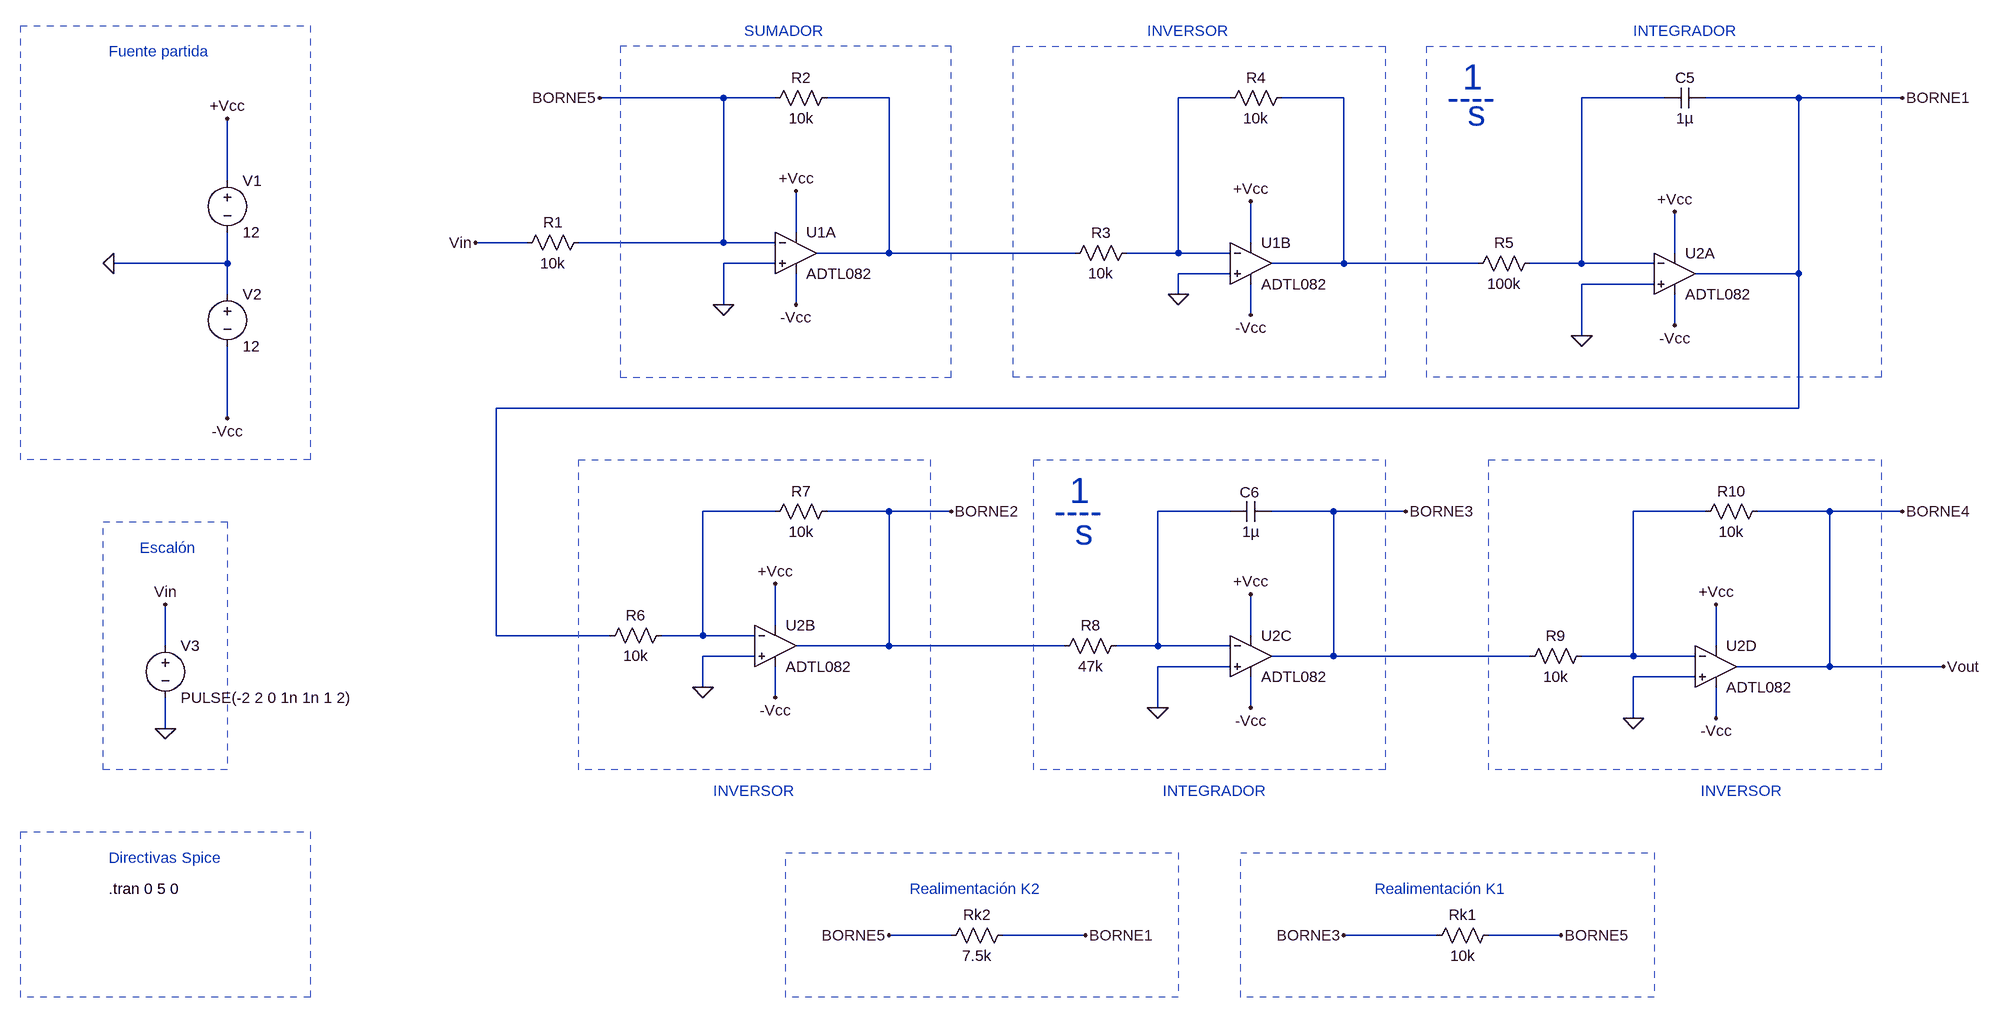
[diagram p0: schematic TP1.asc]
TP1.asc, the LTspice schematic file:
Version 4
SHEET 1 2500 1556
WIRE 128 -80 -64 -80
WIRE 208 -80 128 -80
WIRE 384 -80 288 -80
WIRE 912 -80 832 -80
WIRE 1088 -80 992 -80
WIRE 1584 -80 1456 -80
WIRE 1792 -80 1648 -80
WIRE 1952 -80 1792 -80
WIRE -640 48 -640 -48
WIRE 240 128 240 64
WIRE -176 144 -256 144
WIRE 128 144 128 -80
WIRE 128 144 -96 144
WIRE 208 144 128 144
WIRE 944 144 944 80
WIRE 384 160 384 -80
WIRE 384 160 272 160
WIRE 672 160 384 160
WIRE 832 160 832 -80
WIRE 832 160 752 160
WIRE 912 160 832 160
WIRE 1600 160 1600 96
WIRE -640 176 -640 128
WIRE -640 176 -816 176
WIRE 208 176 128 176
WIRE 1088 176 1088 -80
WIRE 1088 176 976 176
WIRE 1296 176 1088 176
WIRE 1456 176 1456 -80
WIRE 1456 176 1376 176
WIRE 1568 176 1456 176
WIRE 912 192 832 192
WIRE 1792 192 1792 -80
WIRE 1792 192 1632 192
WIRE 1568 208 1456 208
WIRE -640 224 -640 176
WIRE 832 224 832 192
WIRE 128 240 128 176
WIRE 240 240 240 192
WIRE 944 256 944 208
WIRE 1600 272 1600 224
WIRE 1456 288 1456 208
WIRE 1792 400 1792 192
WIRE 1792 400 -224 400
WIRE -640 416 -640 304
WIRE 208 560 96 560
WIRE 384 560 288 560
WIRE 480 560 384 560
WIRE 912 560 800 560
WIRE 1072 560 976 560
WIRE 1184 560 1072 560
WIRE 1648 560 1536 560
WIRE 1840 560 1728 560
WIRE 1952 560 1840 560
WIRE 208 736 208 672
WIRE -224 752 -224 400
WIRE -48 752 -224 752
WIRE 96 752 96 560
WIRE 96 752 32 752
WIRE 176 752 96 752
WIRE 944 752 944 688
WIRE -736 768 -736 704
WIRE 384 768 384 560
WIRE 384 768 240 768
WIRE 656 768 384 768
WIRE 800 768 800 560
WIRE 800 768 736 768
WIRE 912 768 800 768
WIRE 1664 768 1664 704
WIRE 176 784 96 784
WIRE 1072 784 1072 560
WIRE 1072 784 976 784
WIRE 1376 784 1072 784
WIRE 1536 784 1536 560
WIRE 1536 784 1456 784
WIRE 1632 784 1536 784
WIRE 912 800 800 800
WIRE 1840 800 1840 560
WIRE 1840 800 1696 800
WIRE 2016 800 1840 800
WIRE 1632 816 1536 816
WIRE 96 832 96 784
WIRE 208 848 208 800
WIRE 800 864 800 800
WIRE 944 864 944 816
WIRE 1536 880 1536 816
WIRE 1664 880 1664 832
WIRE -736 896 -736 848
WIRE 480 1216 384 1216
WIRE 688 1216 560 1216
WIRE 1232 1216 1088 1216
WIRE 1424 1216 1312 1216
FLAG 128 240 0
FLAG 832 224 0
FLAG 1456 288 0
FLAG 96 832 0
FLAG 800 864 0
FLAG 1536 880 0
FLAG -256 144 Vin
FLAG 240 64 +Vcc
FLAG 944 80 +Vcc
FLAG 1600 96 +Vcc
FLAG 208 672 +Vcc
FLAG 944 688 +Vcc
FLAG 1664 704 +Vcc
FLAG 240 240 -Vcc
FLAG 944 256 -Vcc
FLAG 1600 272 -Vcc
FLAG 208 848 -Vcc
FLAG 944 864 -Vcc
FLAG 1664 880 -Vcc
FLAG 2016 800 Vout
FLAG 1952 -80 BORNE1
FLAG 480 560 BORNE2
FLAG 1184 560 BORNE3
FLAG 1952 560 BORNE4
FLAG -64 -80 BORNE5
FLAG -816 176 0
FLAG -640 -48 +Vcc
FLAG -640 416 -Vcc
FLAG -736 896 0
FLAG -736 704 Vin
FLAG 384 1216 BORNE5
FLAG 688 1216 BORNE1
FLAG 1088 1216 BORNE3
FLAG 1424 1216 BORNE5
SYMBOL res -80 128 R90
WINDOW 0 0 56 VBottom 2
WINDOW 3 32 56 VTop 2
SYMATTR InstName R1
SYMATTR Value 10k
SYMBOL res 304 -96 R90
WINDOW 0 0 56 VBottom 2
WINDOW 3 32 56 VTop 2
SYMATTR InstName R2
SYMATTR Value 10k
SYMBOL res 768 144 R90
WINDOW 0 0 56 VBottom 2
WINDOW 3 32 56 VTop 2
SYMATTR InstName R3
SYMATTR Value 10k
SYMBOL res 1008 -96 R90
WINDOW 0 0 56 VBottom 2
WINDOW 3 32 56 VTop 2
SYMATTR InstName R4
SYMATTR Value 10k
SYMBOL res 1392 160 R90
WINDOW 0 0 56 VBottom 2
WINDOW 3 32 56 VTop 2
SYMATTR InstName R5
SYMATTR Value 100k
SYMBOL res 48 736 R90
WINDOW 0 0 56 VBottom 2
WINDOW 3 32 56 VTop 2
SYMATTR InstName R6
SYMATTR Value 10k
SYMBOL res 752 752 R90
WINDOW 0 0 56 VBottom 2
WINDOW 3 32 56 VTop 2
SYMATTR InstName R8
SYMATTR Value 47k
SYMBOL cap 976 544 R90
WINDOW 0 2 34 VBottom 2
WINDOW 3 32 32 VTop 2
SYMATTR InstName C6
SYMATTR Value 1µ
SYMBOL res 1472 768 R90
WINDOW 0 0 56 VBottom 2
WINDOW 3 32 56 VTop 2
SYMATTR InstName R9
SYMATTR Value 10k
SYMBOL res 1744 544 R90
WINDOW 0 0 56 VBottom 2
WINDOW 3 32 56 VTop 2
SYMATTR InstName R10
SYMATTR Value 10k
SYMBOL voltage -640 32 R0
WINDOW 123 0 0 Left 0
WINDOW 39 0 0 Left 0
SYMATTR InstName V1
SYMATTR Value 12
SYMBOL voltage -640 208 R0
SYMATTR InstName V2
SYMATTR Value 12
SYMBOL voltage -736 752 R0
WINDOW 123 0 0 Left 0
WINDOW 39 0 0 Left 0
SYMATTR InstName V3
SYMATTR Value PULSE(-2 2 0 1n 1n 1 2)
SYMBOL OpAmps\\ADTL082 240 96 R0
SYMATTR InstName U1A
SYMBOL OpAmps\\ADTL082 944 112 R0
SYMATTR InstName U1B
SYMBOL OpAmps\\ADTL082 1600 128 R0
SYMATTR InstName U2A
SYMBOL OpAmps\\ADTL082 208 704 R0
SYMATTR InstName U2B
SYMBOL OpAmps\\ADTL082 944 720 R0
SYMATTR InstName U2C
SYMBOL OpAmps\\ADTL082 1664 736 R0
SYMATTR InstName U2D
SYMBOL res 576 1200 R90
WINDOW 0 0 56 VBottom 2
WINDOW 3 32 56 VTop 2
SYMATTR InstName Rk2
SYMATTR Value 7.5k
SYMBOL cap 1648 -96 R90
WINDOW 0 0 32 VBottom 2
WINDOW 3 32 32 VTop 2
SYMATTR InstName C5
SYMATTR Value 1µ
SYMBOL res 304 544 R90
WINDOW 0 0 56 VBottom 2
WINDOW 3 32 56 VTop 2
SYMATTR InstName R7
SYMATTR Value 10k
SYMBOL res 1328 1200 R90
WINDOW 0 0 56 VBottom 2
WINDOW 3 32 56 VTop 2
SYMATTR InstName Rk1
SYMATTR Value 10k
TEXT -824 1144 Left 2 !.tran 0 5 0
TEXT 160 -184 Left 2 ;SUMADOR
TEXT 784 -184 Left 2 ;INVERSOR
TEXT 1640 992 Left 2 ;INVERSOR
TEXT 112 992 Left 2 ;INVERSOR
TEXT 1536 -184 Left 2 ;INTEGRADOR
TEXT 808 992 Left 2 ;INTEGRADOR
TEXT 1272 -112 Left 5 ;1
TEXT 1248 -80 Left 5 ;----
TEXT 1280 -56 Left 5 ;s
TEXT 664 528 Left 5 ;1
TEXT 640 560 Left 5 ;----
TEXT 672 592 Left 5 ;s
TEXT -824 1096 Left 2 ;Directivas Spice
TEXT -776 616 Left 2 ;Escalón
TEXT -824 -152 Left 2 ;Fuente partida
TEXT 416 1144 Left 2 ;Realimentación K2
TEXT 1136 1144 Left 2 ;Realimentación K1
RECTANGLE Normal 1152 352 576 -160 2
RECTANGLE Normal 1920 352 1216 -160 2
RECTANGLE Normal -32 352 480 -160 2
RECTANGLE Normal 448 960 -96 480 2
RECTANGLE Normal 1152 960 608 480 2
RECTANGLE Normal 1920 960 1312 480 2
RECTANGLE Normal -512 480 -960 -192 2
RECTANGLE Normal -640 960 -832 576 2
RECTANGLE Normal -512 1312 -960 1056 2
RECTANGLE Normal 832 1312 224 1088 2
RECTANGLE Normal 1568 1312 928 1088 2

The netlist it stands for:
* TP1.asc
R1 BORNE5 Vin 10k
R2 N001 BORNE5 10k
R3 N002 N001 10k
R4 N003 N002 10k
R5 N004 N003 100k
R6 N005 BORNE1 10k
R8 N006 BORNE2 47k
C6 BORNE3 N006 1µ
R9 N007 BORNE3 10k
R10 BORNE4 N007 10k
V1 +Vcc 0 12
V2 0 -Vcc 12
V3 Vin 0 PULSE(-2 2 0 1n 1n 1 2)
XU1A 0 BORNE5 +Vcc -Vcc N001 ADTL082  ; pins In+ In- V+ V- OUT
XU1B 0 N002 +Vcc -Vcc N003 ADTL082  ; pins In+ In- V+ V- OUT
XU2A 0 N004 +Vcc -Vcc BORNE1 ADTL082  ; pins In+ In- V+ V- OUT
XU2B 0 N005 +Vcc -Vcc BORNE2 ADTL082  ; pins In+ In- V+ V- OUT
XU2C 0 N006 +Vcc -Vcc BORNE3 ADTL082  ; pins In+ In- V+ V- OUT
XU2D 0 N007 +Vcc -Vcc BORNE4 ADTL082  ; pins In+ In- V+ V- OUT
Rk2 BORNE1 BORNE5 7.5k
C5 BORNE1 N004 1µ
R7 BORNE2 N005 10k
Rk1 BORNE5 BORNE3 10k
.tran 0 5 0
* SUMADOR
* INVERSOR
* INVERSOR
* INVERSOR
* INTEGRADOR
* INTEGRADOR
* 1
* ----
* s
* 1
* ----
* s
* Directivas Spice
* Escalón
* Fuente partida
* Realimentación K2
* Realimentación K1
.lib ADI.lib
.backanno
.end